# Altium schematic sheet Current_Shunt_Amplifier.SchDoc
size A4; SheetNumber: 8; SheetTotal: 9
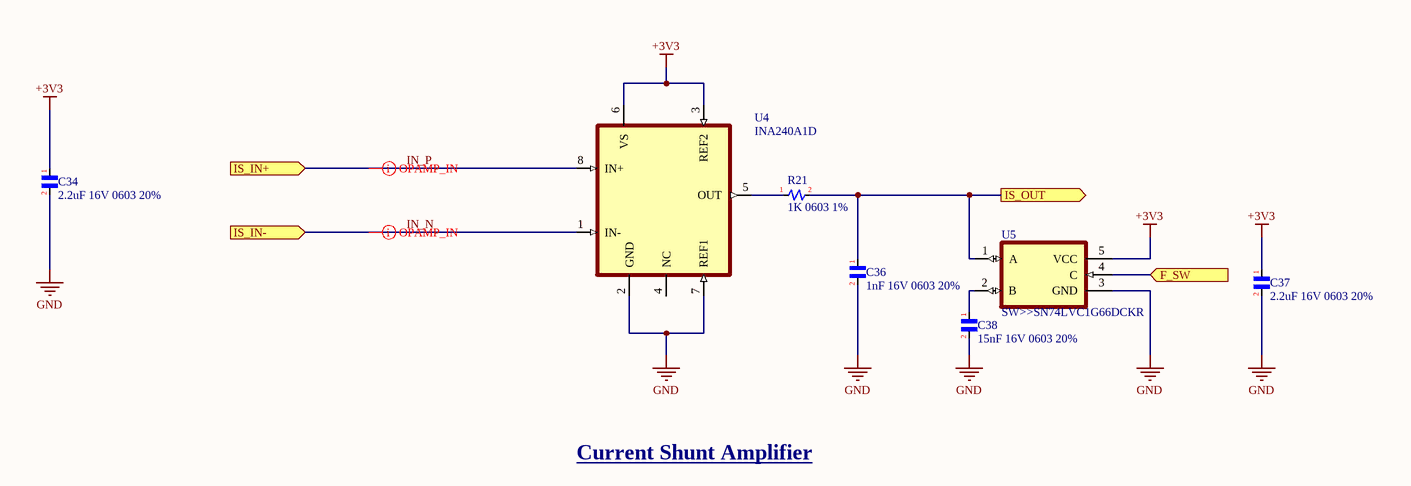
[diagram p0: Current_Shunt_Amplifier.SchDoc]

## Parts
C34  2.2uF 16V 0603 20%  [C_0603]
C36  1nF 16V 0603 20%  [C_0603]
C37  2.2uF 16V 0603 20%  [C_0603]
C38  15nF 16V 0603 20%  [C_0603]
R21  1K 0603 1%  [R_0603]
U4  INA240A1D  [SOIC127P599X175-8N]
U5  SW>>SN74LVC1G66DCKR  [SOT65P210X110-5N]

## Ports
F_SW (in, see Mosfets[3C], Mcu[3C], Mosfets[4C]), IS_IN+ (in, see Mosfets[3C]), IS_IN- (in, see Mosfets[3C]), IS_OUT (out, see Mosfets[3C])

## Nets
+3V3: C34.1 C37.1 U4.3(REF2) U4.6(VS) U5.5(VCC)
GND: C34.2 C36.2 C37.2 C38.2 U4.2(GND) U4.7(REF1) U5.3(GND)
F_SW: U5.4(C) ; port F_SW
IN_N: U4.1(IN-) ; port IS_IN-
IN_P: U4.8(IN+) ; port IS_IN+
IS_OUT: C36.1 R21.2 U5.1(A) ; port IS_OUT
NetC38_1: C38.1 U5.2(B)
NetR21_1: R21.1 U4.5(OUT)

Not connected (* = marked no-connect by the designer): U4 4(NC)

## Layout directives
differential pair: IN_N, IN_P

## Notes on the sheet
- Current Shunt Amplifier

## Library data of the parts
C34 C36-C38 = Capacitor>> Non-Polar: CAP  0603 20%
R21 = Resistor>> General Purpose: RES 0603 20%
U4 = INA240A1D: -4 to 80V, bidirectional, ultra-precise current sense amplifier with enhanced PWM rejection; MF: Texas Instruments; SnapEDA_Link: https://www.snapeda.com/parts/INA240A1D/Texas+Instruments/view-part/?ref=snap; Package: SOIC-8 Texas Instruments; Value: *; MP: INA240A1D; Check_prices: https://www.snapeda.com/parts/INA240A1D/Texas+Instruments/view-part/?ref=eda
U5 = SW>>SN74LVC1G66DCKR: 5-V, 1:1 (SPST), 1-channel analog switch; MF: Texas Instruments; SnapEDA_Link: https://www.snapeda.com/parts/SN74LVC1G66DCKR/Texas+Instruments/view-part/?ref=snap; Package: SC70-5 Texas Instruments; Value: *; MP: SN74LVC1G66DCKR; Check_prices: https://www.snapeda.com/parts/SN74LVC1G66DCKR/Texas+Instruments/view-part/?ref=eda